# EasyEDA schematic BTPlayer.json
TITLE: BlueTooth Player; REV: 1.0; Date: 2019-01-04; Sheet: 1/1; Drawn By: sergeydsi
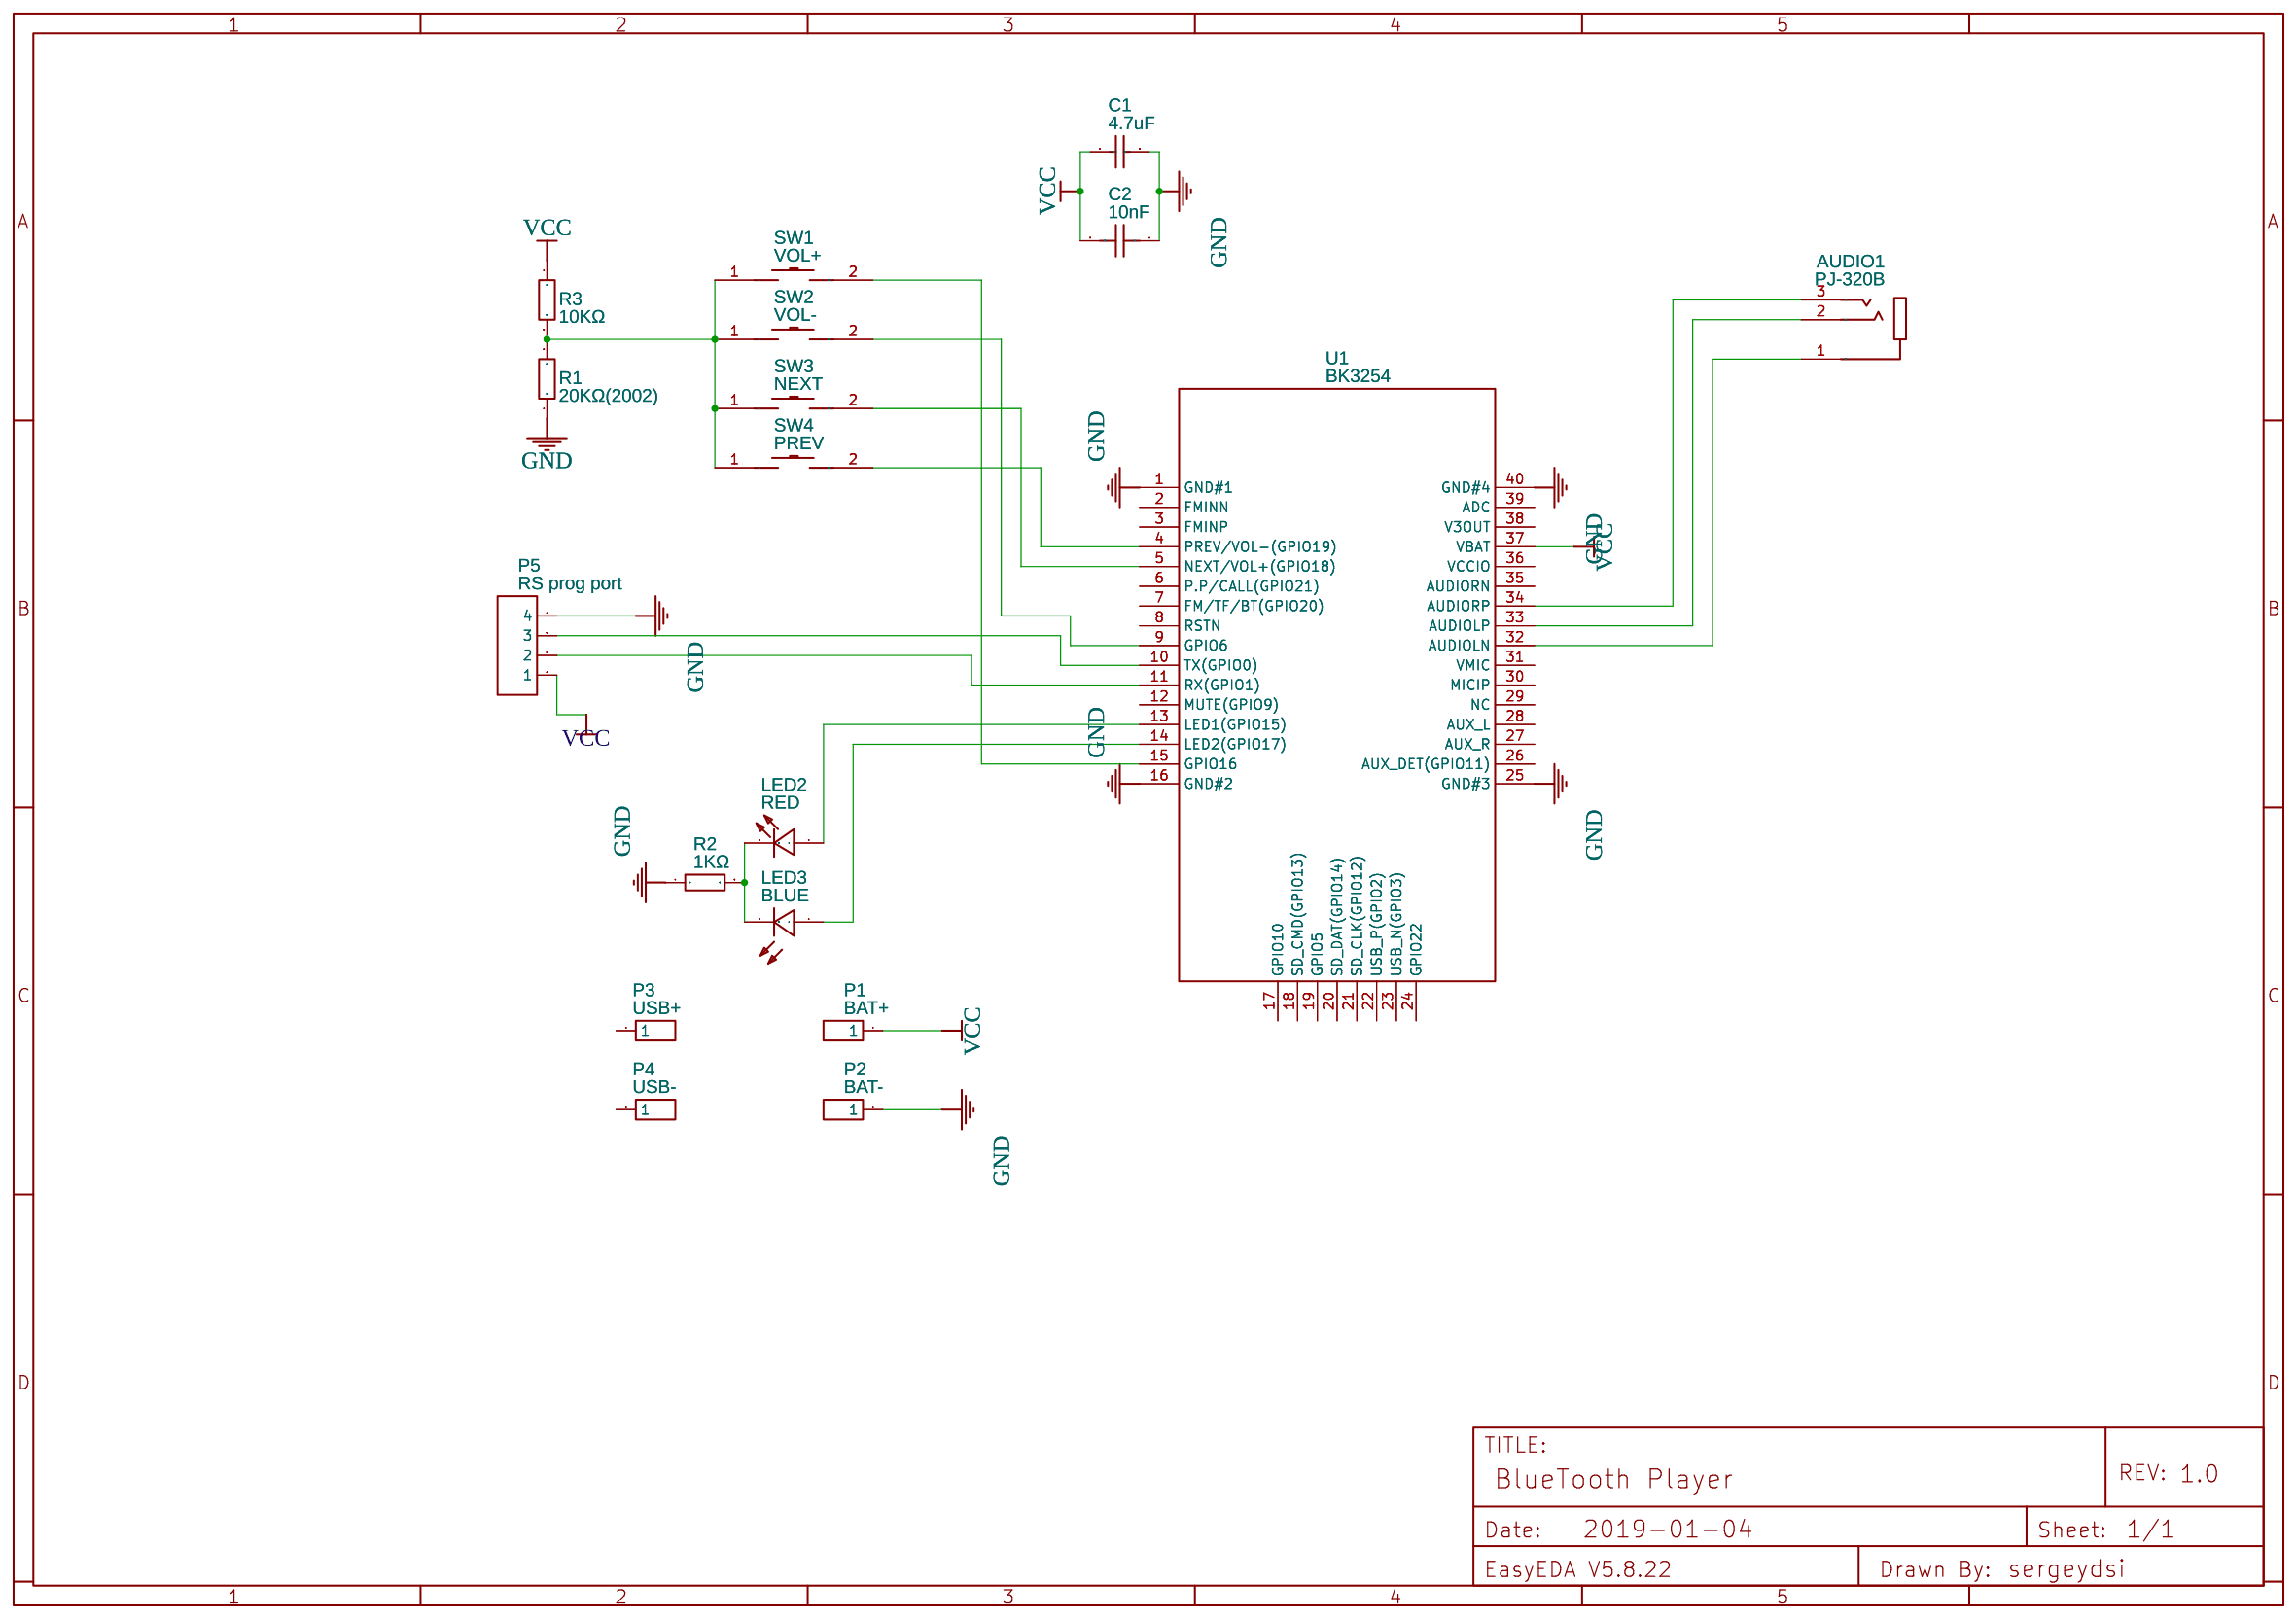
[diagram p0: schematic sheet]

## Parts
AUDIO1  PJ-320B  [PJ-320B]
C1  4.7uF  [1206]
C2  10nF  [1206]
LED2  RED  [LED-SMD-1.7X0.6X1.1-CT(2P)]
LED3  BLUE  [LED-0805]
P1  BAT+  [HDR-1X1/2.54]
P2  BAT-  [HDR-1X1/2.54]
P3  USB+  [HDR-1X1/2.54]
P4  USB-  [HDR-1X1/2.54]
P5  RS prog port  [HDR-4X1/2.54]
R1  20KΩ(2002)  [0603]
R2  1KΩ  [0805]
R3  10KΩ  [0603]
SW1  VOL+  [K2-1112SA-A4SW-01]
SW2  VOL-  [K2-1112SA-A4SW-01]
SW3  NEXT  [K2-1112SA-A4SW-01]
SW4  PREV  [K2-1112SA-A4SW-01]
U1  BK3254  [BK3254]

## Library data of the parts
AUDIO1 = -: Supplier Part: C18594; Supplier: LCSC; Manufacturer: BOOMELE; Contributor: LCSC
C1 = 1206F475M500NT: Supplier: LCSC; Manufacturer: FH; Supplier Part: C46818
C2 = 1206B103K500: Supplier: LCSC; Manufacturer: WTC; Contributor: LCSC; Supplier Part: C152840
LED2 = -: Supplier: LCSC; Supplier Part: C183327; Manufacturer: Everlight Elec; Manufacturer Part: 27-21/R6C-AP1Q2B/3C; Contributor: LCSC
LED3 = -: Supplier: LCSC; Supplier Part: C131261; Manufacturer: Everlight Elec; Manufacturer Part: 27-21/BHC-AN1P2/3C; Contributor: LCSC
P1-P4 = -: Supplier Part: C81276; Supplier: LCSC; Manufacturer: ReliaPro; Manufacturer Part: Header-Male-2.54_1x1
P5 = -: Supplier Part: C124413; Supplier: LCSC; Manufacturer: ReliaPro; Manufacturer Part: Header-Female-2.54_1x4
R1 = RTT032002FTP: Supplier: LCSC; Manufacturer: RALEC; Supplier Part: C103391
R2 = 0805W8F1001T5E: Supplier: LCSC; Manufacturer: UniOhm; LCSC Assembly: Yes; Supplier Part: C17513
R3 = 0603WAJ0103T5E: Supplier: LCSC; Manufacturer: UniOhm; Supplier Part: C15401
SW1-SW4 = -: Supplier: LCSC; Manufacturer: HRO; Contributor: LCSC; Supplier Part: C128949
U1 = -: Contributor: jazzyhat

## Nets
GND: C1.2 C2.1 P2.1 P5.4 R1.1 R2.1 U1.1(GND#1) U1.16(GND#2) U1.25(GND#3) U1.40(GND#4)
VCC: C1.1 C2.2 P1.1 P5.1 R3.1 U1.37(VBAT)
Net-(AUDIO1-1): AUDIO1.1 U1.32(AUDIOLN)
Net-(AUDIO1-2): AUDIO1.2 U1.33(AUDIOLP)
Net-(AUDIO1-3): AUDIO1.3 U1.34(AUDIORP)
Net-(LED2-1): LED2.1(A) U1.13(LED1(GPIO15))
Net-(LED2-2): LED2.2(C) LED3.2(C) R2.2
Net-(LED3-1): LED3.1(A) U1.14(LED2(GPIO17))
Net-(P5-2): P5.2 U1.11(RX(GPIO1))
Net-(P5-3): P5.3 U1.10(TX(GPIO0))
Net-(R1-2): R1.2 R3.2 SW1.1 SW2.1 SW3.1 SW4.1
Net-(SW1-2): SW1.2 U1.15(GPIO16)
Net-(SW2-2): SW2.2 U1.9(GPIO6)
Net-(SW3-2): SW3.2 U1.5(NEXT/VOL+(GPIO18))
Net-(SW4-2): SW4.2 U1.4(PREV/VOL-(GPIO19))

Not connected (* = marked no-connect by the designer): P3 1; P4 1; U1 2(FMINN) 3(FMINP) 6(P.P/CALL(GPIO21)) 7(FM/TF/BT(GPIO20)) 8(RSTN) 12(MUTE(GPIO9)) 17(GPIO10) 18(SD_CMD(GPIO13)) 19(GPIO5) 20(SD_DAT(GPIO14)) 21(SD_CLK(GPIO12)) 22(USB_P(GPIO2)) 23(USB_N(GPIO3)) 24(GPIO22) 26(AUX_DET(GPIO11)) 27(AUX_R) 28(AUX_L) 29(NC) 30(MICIP) 31(VMIC) 35(AUDIORN) 36(VCCIO) 38(V3OUT) 39(ADC)
